# EAGLE design PIN_1_1 (EAGLE 8.3.2)
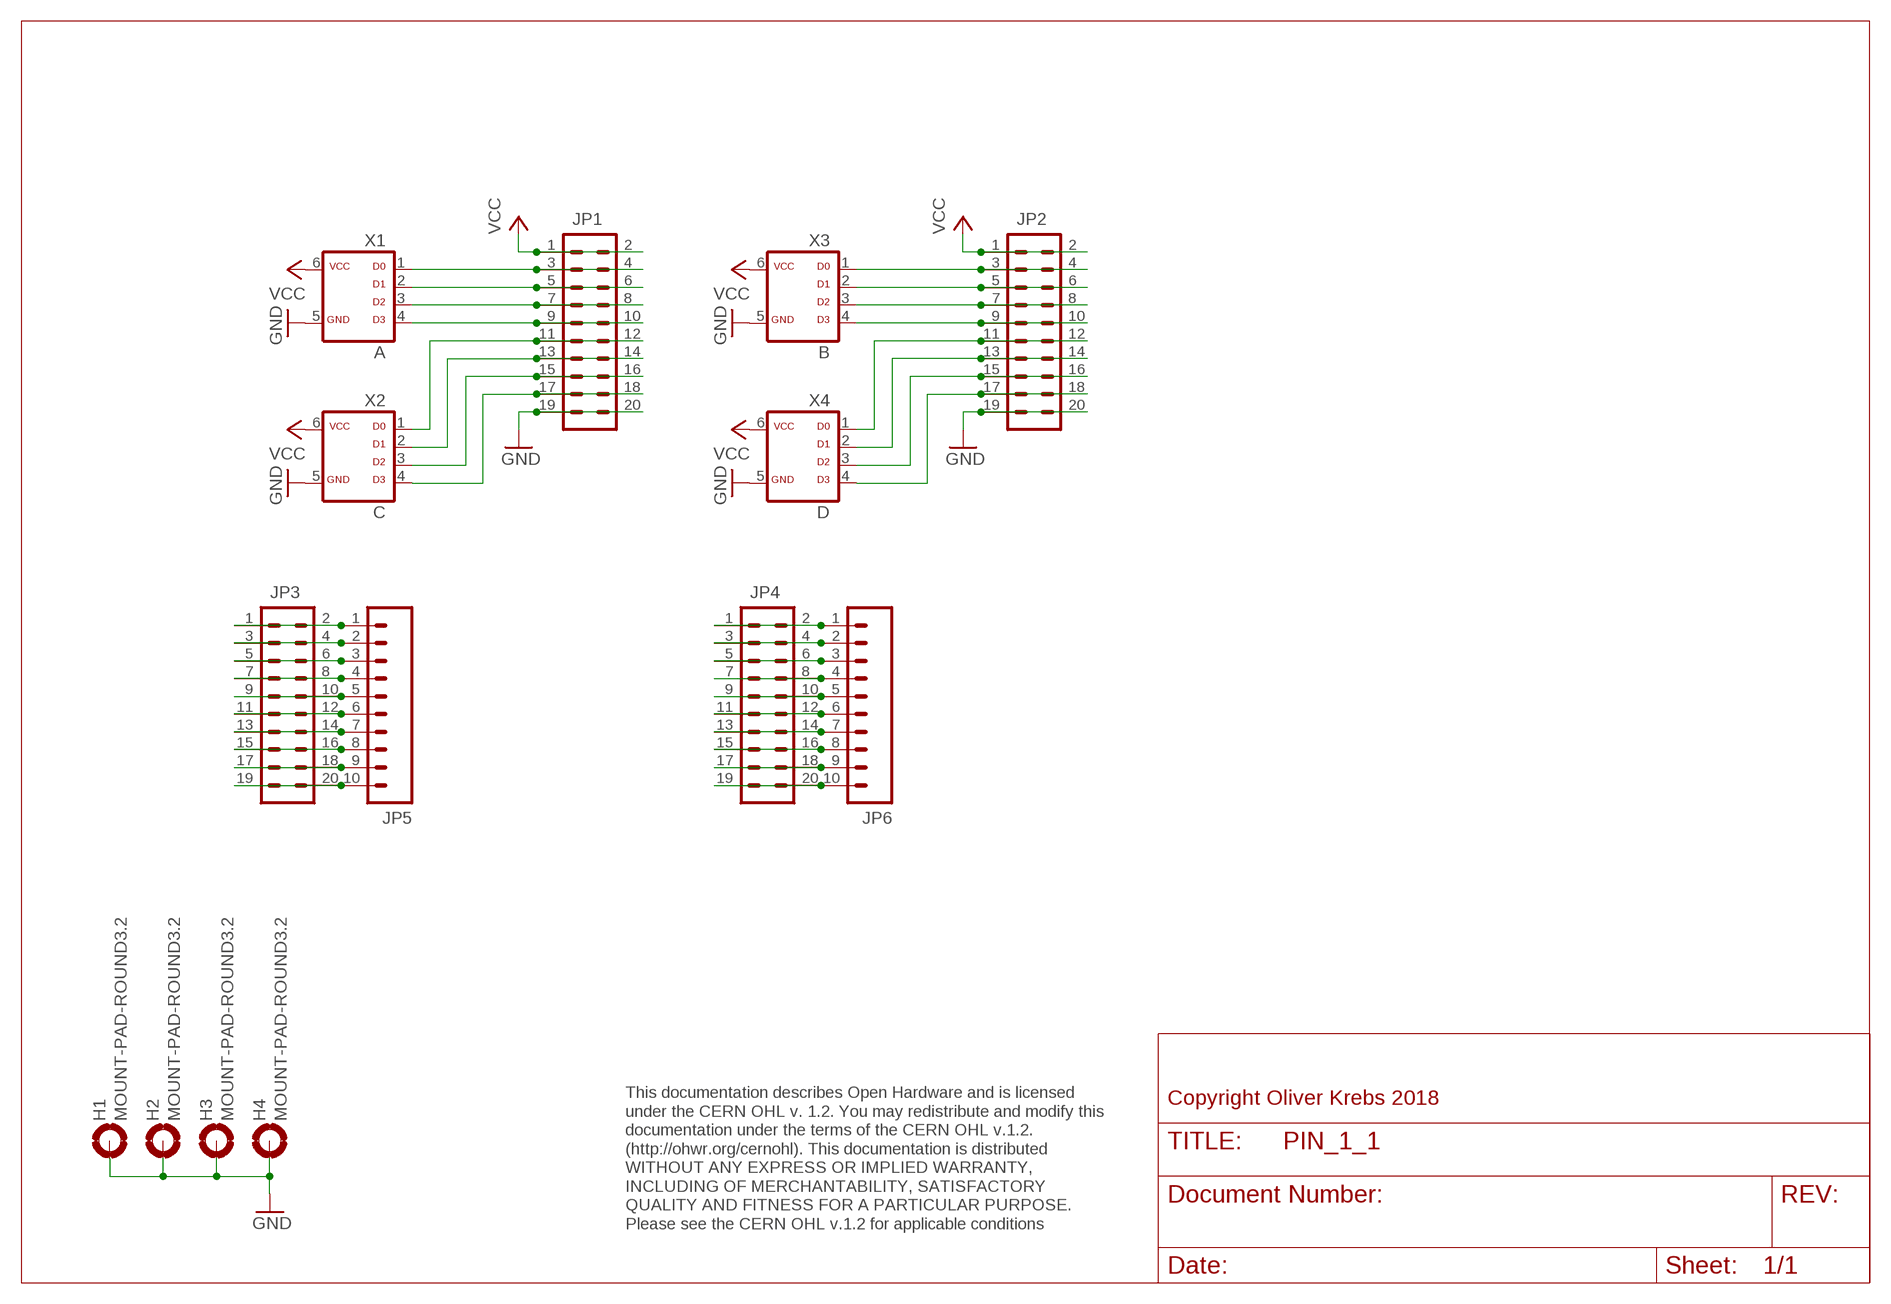
[diagram p0: schematic, sheet 1]

## Parts
H1  MOUNT-PAD-ROUND3.2  [3,2-PAD]
H2  MOUNT-PAD-ROUND3.2  [3,2-PAD]
H3  MOUNT-PAD-ROUND3.2  [3,2-PAD]
H4  MOUNT-PAD-ROUND3.2  [3,2-PAD]
JP1  M10X2  [2X10]
JP2  M10X2  [2X10]
JP3  M10X2  [2X10]
JP4  M10X2  [2X10]
JP5  M10SILK_FEMALE_PTH  [1X10]
JP6  M10SILK_FEMALE_PTH  [1X10]
X1  A  ML6D  [ML-6]
X2  C  ML6D  [ML-6]
X3  B  ML6D  [ML-6]
X4  D  ML6D  [ML-6]

## Nets
GND: H1.B3,2(MOUNT) H2.B3,2(MOUNT) H3.B3,2(MOUNT) H4.B3,2(MOUNT) JP1.19 JP1.20 JP2.19 JP2.20 X1.5 X2.5 X3.5 X4.5
N$1: JP2.3 JP2.4 X3.1
N$2: JP2.5 JP2.6 X3.2
N$3: JP2.7 JP2.8 X3.3
N$4: JP2.9 JP2.10 X3.4
N$5: JP2.11 JP2.12 X4.1
N$6: JP2.13 JP2.14 X4.2
N$7: JP2.15 JP2.16 X4.3
N$8: JP2.17 JP2.18 X4.4
N$9: JP1.3 JP1.4 X1.1
N$10: JP1.5 JP1.6 X1.2
N$11: JP1.7 JP1.8 X1.3
N$12: JP1.9 JP1.10 X1.4
N$13: JP1.11 JP1.12 X2.1
N$14: JP1.13 JP1.14 X2.2
N$15: JP1.15 JP1.16 X2.3
N$16: JP1.17 JP1.18 X2.4
N$17: JP3.1 JP3.2 JP5.1
N$18: JP3.3 JP3.4 JP5.2
N$19: JP3.5 JP3.6 JP5.3
N$20: JP3.7 JP3.8 JP5.4
N$21: JP4.7 JP4.8 JP6.4
N$22: JP3.11 JP3.12 JP5.6
N$23: JP3.13 JP3.14 JP5.7
N$24: JP3.15 JP3.16 JP5.8
N$25: JP3.17 JP3.18 JP5.9
N$26: JP3.19 JP3.20 JP5.10
N$27: JP4.1 JP4.2 JP6.1
N$28: JP4.3 JP4.4 JP6.2
N$29: JP4.5 JP4.6 JP6.3
N$30: JP4.9 JP4.10 JP6.5
N$31: JP3.9 JP3.10 JP5.5
N$32: JP4.11 JP4.12 JP6.6
N$33: JP4.13 JP4.14 JP6.7
N$34: JP4.15 JP4.16 JP6.8
N$35: JP4.17 JP4.18 JP6.9
N$36: JP4.19 JP4.20 JP6.10
VCC: JP1.1 JP1.2 JP2.1 JP2.2 X1.6 X2.6 X3.6 X4.6

## Notes on the sheet
- Copyright Oliver Krebs 2018
- This documentation describes Open Hardware and is licensed 
  under the CERN OHL v. 1.2. You may redistribute and modify this 
  documentation under the terms of the CERN OHL v.1.2. 
  (http://ohwr.org/cernohl). This documentation is distributed
  WITHOUT ANY EXPRESS OR IMPLIED WARRANTY, 
  INCLUDING OF MERCHANTABILITY, SATISFACTORY 
  QUALITY AND FITNESS FOR A PARTICULAR PURPOSE. 
  Please see the CERN OHL v.1.2 for applicable conditions

## Library data of the parts
H1-H4 = holes:MOUNT-PAD-ROUND: MOUNTING PAD, round
JP1-JP4 = SparkFun-Connectors:M10X2: This was SPECIALLY designed to be used with our Graphic LCD Backpack. Be sure you want to use this! It is not only staggered on each line of header holes, but IT IS ALSO offset of the center point of the top and bottom lines by 5 mil. This causes the headers to lock into place on the "standard" footprint on the LCD screen. The extra squares on the tdocu layer are there simply to reference other pins (if you were to actually populate a longer header than ten long - this is what we do with the backpacks).
JP5 JP6 = SparkFun-Connectors:M10: Header 10 Standard 10-pin 0.1" header. Use with straight break away headers (SKU : PRT-00116), right angle break away headers (PRT-00553), swiss pins (PRT-00743), machine pins (PRT-00117), and female headers (PRT-00115).; PROD_ID: CONN-11563
X1-X4 = 01-my-con:ML6D

## Board
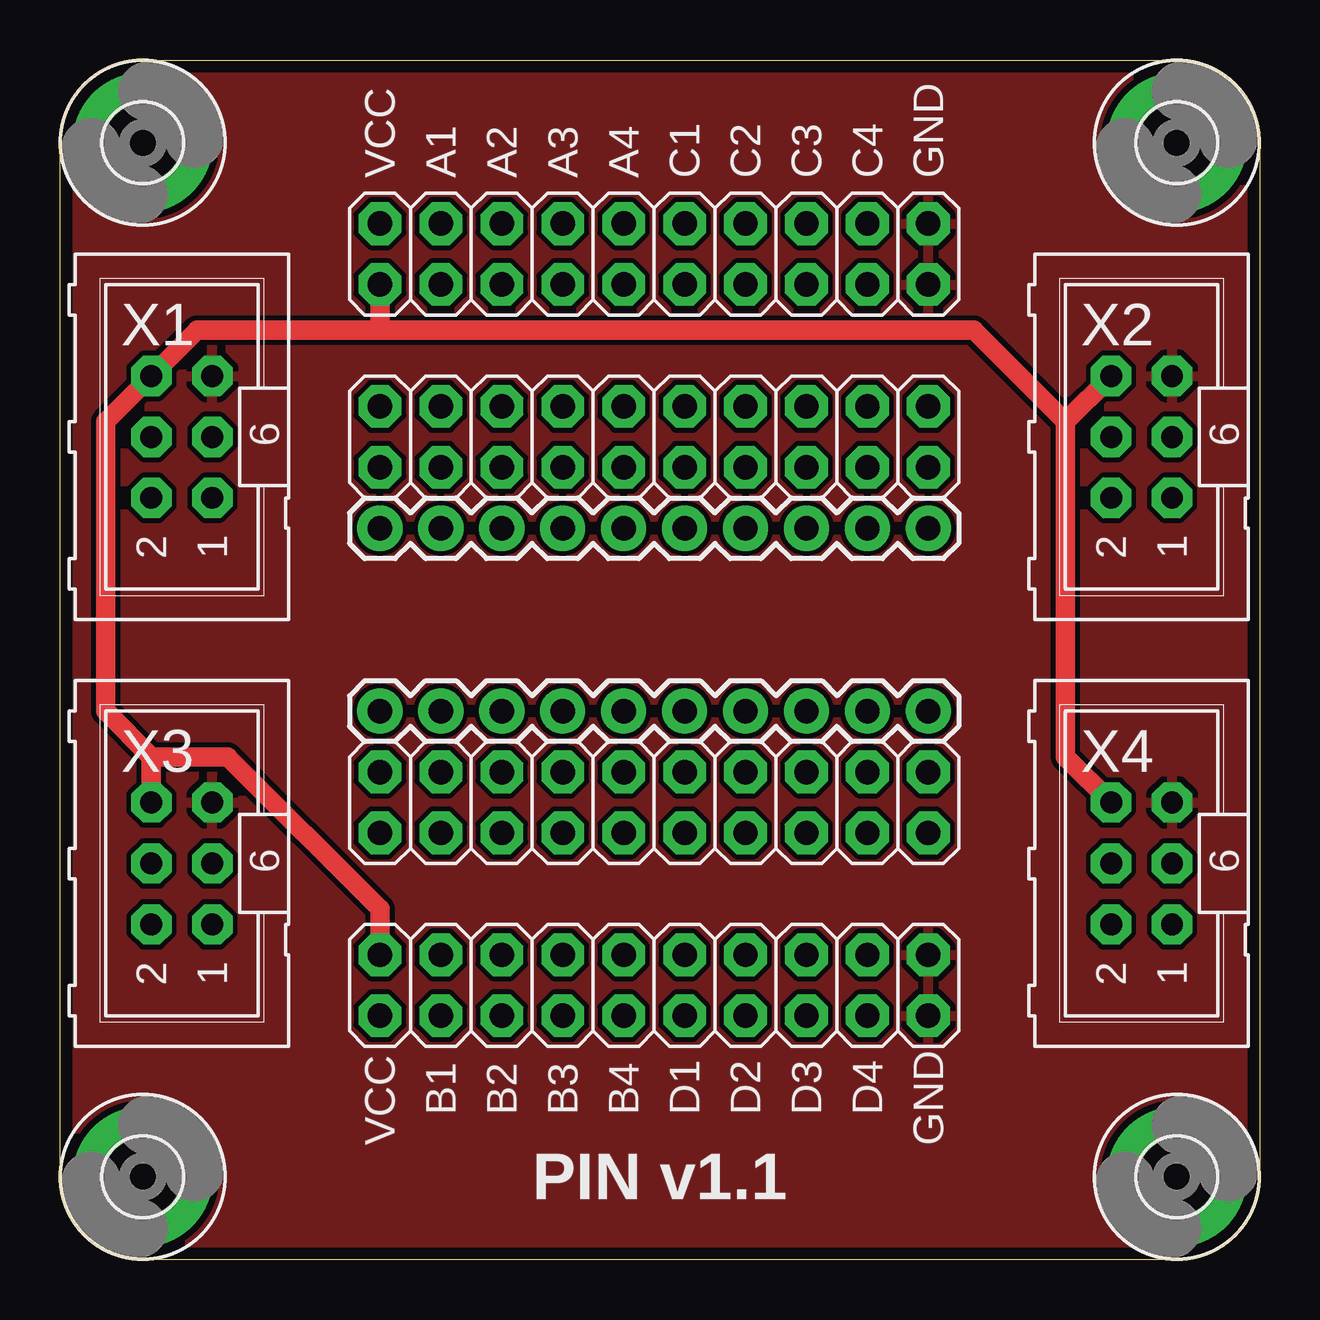
[diagram p1: board, top side]
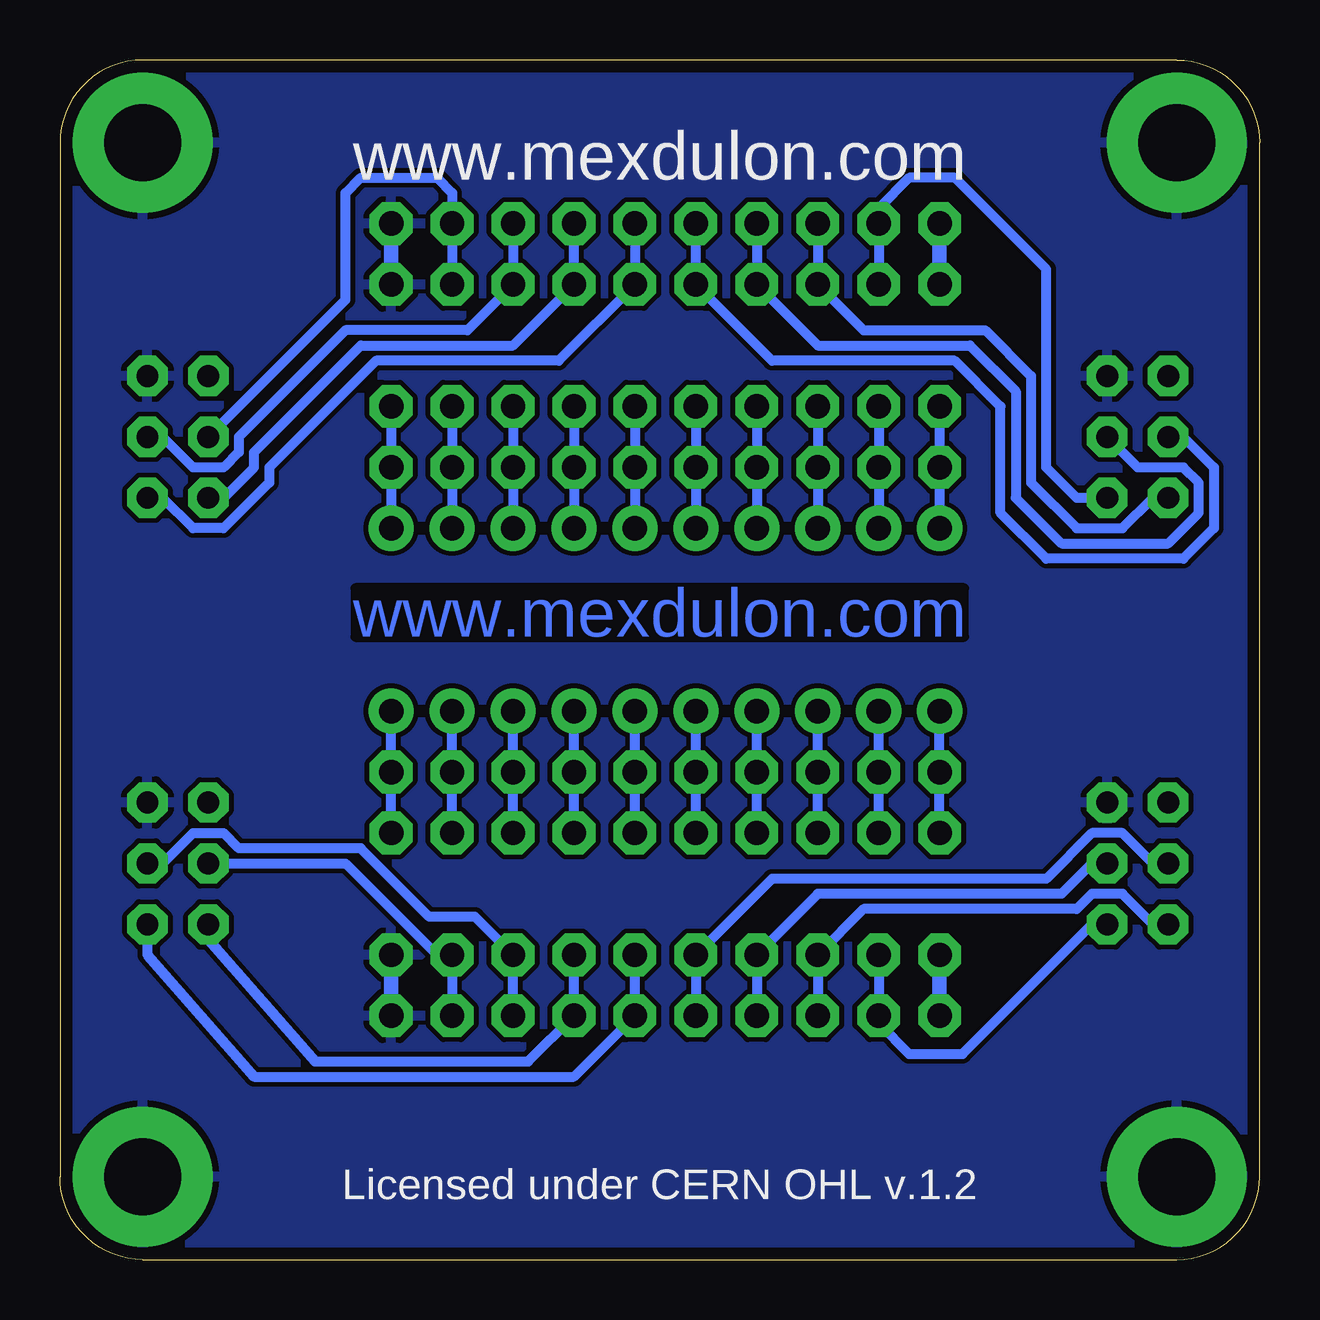
[diagram p2: board, bottom side, seen from below]

Size 50 x 50 mm. Coordinates in mm from the lower left corner, seen from the top.
Outline: 0,3.45 0,46.55 arc-90 3.45,50 46.55,50 arc-90 50,46.55 50,3.45 arc-90 46.55,0 3.45,0 arc-90 0,3.45
Copper layers (1*16): Top 0.035mm / dielectric 1.6mm / Bottom 0.035mm
Design rules "Elecrow_2-layer_PCB_eagle_rule_8mil": minimum track width 8mil, minimum drill 12mil, track to track 8mil, track to pad 8mil, pad to pad 8mil, via to via 8mil, smd to smd 0mil, copper to edge 20mil, drill to drill 10mil, minimum pad ring 6mil, minimum via ring 6mil, stop-mask expansion 0mil, vias tented up to drill 100mil, thermal gap 10mil

### Footprints (pad centres in the part's own frame; a part is rotated, then mirrored left to right if it is on the bottom)
3,2-PAD = drill 3.2 pad 5.842: B3,2 0,0
2X10 = drill 1.016 pad 1.778 octagon: 1 -11.43,-1.27; 2 -11.43,1.27; 3 -8.89,-1.27; 4 -8.89,1.27; 5 -6.35,-1.27; 6 -6.35,1.27; 7 -3.81,-1.27; 8 -3.81,1.27; 9 -1.27,-1.27; 10 -1.27,1.27; 11 1.27,-1.27; 12 1.27,1.27; 13 3.81,-1.27; 14 3.81,1.27; 15 6.35,-1.27; 16 6.35,1.27; 17 8.89,-1.27; 18 8.89,1.27; 19 11.43,-1.27; 20 11.43,1.27
1X10 = drill 1.016 pad 1.88: 1 0,0; 2 2.54,0; 3 5.08,0; 4 7.62,0; 5 10.16,0; 6 12.7,0; 7 15.24,0; 8 17.78,0; 9 20.32,0; 10 22.86,0
ML-6 = drill 0.914 pad 1.676 octagon: 1 -2.54,-1.27; 2 -2.54,1.27; 3 0,-1.27; 4 0,1.27; 5 2.54,-1.27; 6 2.54,1.27

### Placement (x,y rotation side)
H1  3.45,3.45 0 top
H2  3.45,46.55 0 top
H3  46.55,3.45 0 top
H4  46.55,46.55 0 top
JP1  24.77,41.91 0 top
JP2  24.77,11.43 0 top
JP3  24.77,34.29 0 top
JP4  24.77,19.05 0 top
JP5  13.34,30.48 0 top
JP6  13.34,22.86 0 top
X1  5.08,34.29 90 top
X2  45.09,34.29 90 top
X3  5.08,16.51 90 top
X4  45.09,16.51 90 top

### Tracks (layer width: path | path; a pad name or v marks a point on that pad's centre or on a via)
GND
  Bottom 0.61: JP1.20 JP1.19 | JP2.19 JP2.20
  pour Bottom: 0,0 50.8,0 50.8,50.8 0,50.8
  pour Top: 0,50.16 50.16,50.16 50.16,0 0,0
N$1
  Bottom 0.406: JP2.4 JP2.3 15.88,9.84 14.61,8.57 12.38,8.57 6.99,13.97 X3.1
N$2
  Bottom 0.406: JP2.5 JP2.6 16.51,14.61 7.62,14.61 6.99,15.24 5.71,15.24 4.45,13.97 X3.2
N$3
  Bottom 0.406: JP2.7 JP2.8 18.41,15.24 8.26,15.24 6.99,16.51 X3.3
N$4
  Bottom 0.406: JP2.9 JP2.10 20.32,15.88 8.89,15.88 6.99,17.78 5.71,17.78 4.45,16.51 X3.4
N$5
  Bottom 0.406: JP2.12 JP2.11 28.57,7.62 41.91,7.62 46.35,12.7 X4.1
N$6
  Bottom 0.406: JP2.14 JP2.13 30.48,8.26 39.37,8.26 43.81,13.34 X4.2
N$7
  Bottom 0.406: JP2.15 JP2.16 32.7,14.29 34.61,14.29 37.47,17.14 42.55,17.14 43.18,17.78 44.45,17.78 45.72,16.51 X4.3
N$8
  Bottom 0.406: JP2.17 JP2.18 34.29,12.7 38.1,16.51 X4.4
N$9
  Bottom 0.406: JP1.3 JP1.4 15.88,43.81 14.61,45.09 12.7,45.09 8.89,41.27 8.89,33.02 7.62,31.75 X1.1
N$10
  Bottom 0.406: JP1.6 JP1.5 16.51,38.73 11.43,38.73 9.53,36.83 9.53,32.38 7.62,30.48 5.71,30.48 4.45,31.75 X1.2
N$11
  Bottom 0.406: JP1.8 JP1.7 18.41,38.1 12.06,38.1 10.16,36.2 10.16,31.75 8.26,29.84 3.81,29.84 2.54,31.11 2.54,32.38 3.17,33.02 5.08,33.02 X1.3
N$12
  Bottom 0.406: JP1.10 JP1.9 20.32,37.47 12.7,37.47 10.79,35.56 10.79,31.11 8.89,29.21 3.17,29.21 1.91,30.48 1.91,33.02 3.17,34.29 X1.4
N$13
  Bottom 0.406: JP1.12 JP1.11 29.21,37.47 36.83,37.47 41.27,33.02 41.27,32.38 43.18,30.48 44.45,30.48 45.72,31.75 X2.1
N$14
  Bottom 0.406: JP1.14 JP1.13 31.11,38.1 37.47,38.1 41.91,33.66 41.91,33.02 43.18,31.75 X2.2
N$15
  Bottom 0.406: JP1.16 JP1.15 33.02,38.73 38.1,38.73 42.55,34.29 42.55,33.66 43.18,33.02 44.45,33.02 45.72,34.29 X2.3
N$16
  Bottom 0.406: JP1.17 JP1.18 33.66,44.45 34.29,45.09 37.47,45.09 38.1,44.45 38.1,40.01 X2.4
N$17
  Bottom 0.406: JP3.2 JP3.1 JP5.1
N$18
  Bottom 0.406: JP3.4 JP3.3 JP5.2
N$19
  Bottom 0.406: JP3.6 JP3.5 JP5.3
N$20
  Bottom 0.406: JP3.8 JP3.7 JP5.4
N$21
  Bottom 0.406: JP4.7 JP4.8 JP6.4
N$22
  Bottom 0.406: JP3.12 JP3.11 JP5.6
N$23
  Bottom 0.406: JP3.14 JP3.13 JP5.7
N$24
  Bottom 0.406: JP3.16 JP3.15 JP5.8
N$25
  Bottom 0.406: JP3.18 JP3.17 JP5.9
N$26
  Bottom 0.406: JP3.20 JP3.19 JP5.10
N$27
  Bottom 0.406: JP4.1 JP4.2 JP6.1
N$28
  Bottom 0.406: JP4.3 JP4.4 JP6.2
N$29
  Bottom 0.406: JP4.5 JP4.6 JP6.3
N$30
  Bottom 0.406: JP4.9 JP4.10 JP6.5
N$31
  Bottom 0.406: JP3.10 JP3.9 JP5.5
N$32
  Bottom 0.406: JP4.11 JP4.12 JP6.6
N$33
  Bottom 0.406: JP4.13 JP4.14 JP6.7
N$34
  Bottom 0.406: JP4.15 JP4.16 JP6.8
N$35
  Bottom 0.406: JP4.17 JP4.18 JP6.9
N$36
  Bottom 0.406: JP4.19 JP4.20 JP6.10
VCC
  Top 0.813: X4.6 41.91,20.95 41.91,34.92 | 41.91,34.92 X2.6 | JP2.2 13.34,14.61 6.99,20.95 3.81,20.95 | 3.81,20.95 1.91,22.86 1.91,34.92 X1.6 5.71,38.73 13.34,38.73 | X3.6 3.81,20.95 | 13.34,38.73 38.1,38.73 41.91,34.92 | JP1.1 13.34,38.73
  Bottom 0.61: JP1.2 JP1.1 | JP2.1 JP2.2

### Text on the board
Bottom: www.mexdulon.com
tNames: VCC | A1 | A2 | A3 | A4 | C1 | C2 | C3 | C4 | GND | B1 | B2 | B3 | B4 | D1 | D2 | D3 | D4 | VCC | GND | PIN v1.1
bNames: www.mexdulon.com | Licensed under CERN OHL v.1.2